# Altium schematic sheet 10.PCIE2.SchDoc
size 297 x 209 mm; SheetNumber: 10; SheetTotal: 13
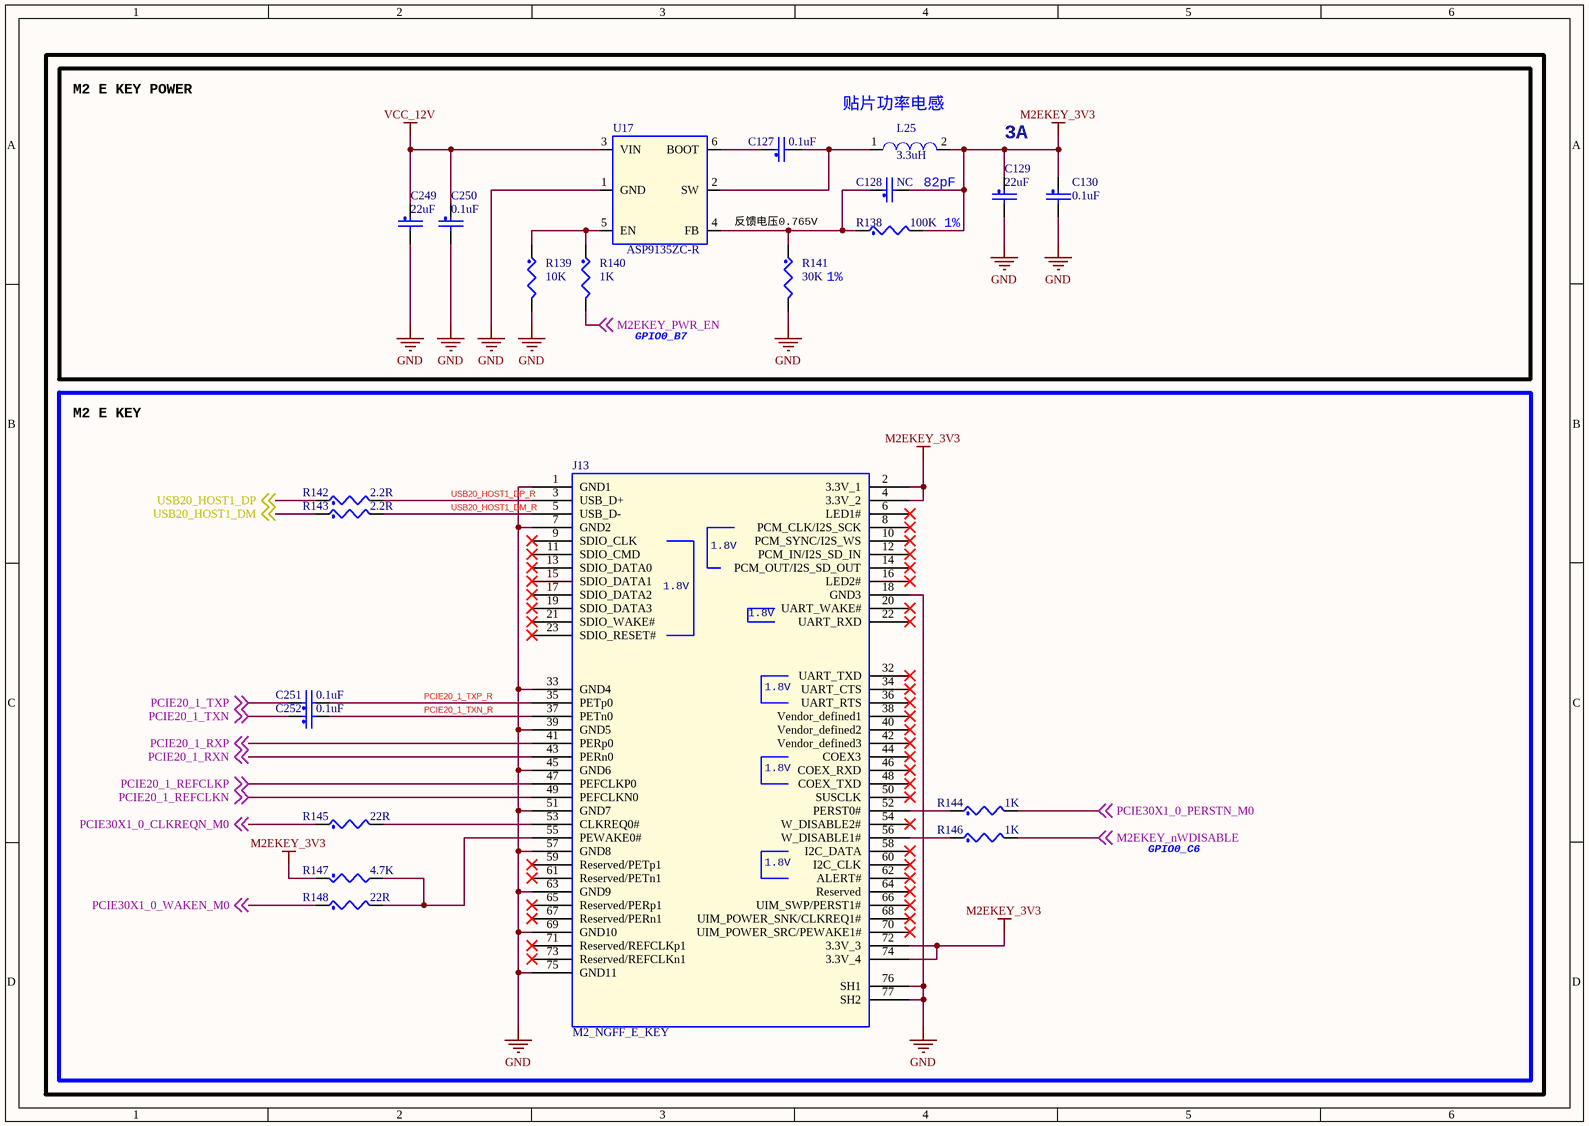
[diagram p0: 10.PCIE2.SchDoc]

## Parts
C127  0.1uF  [C0402]
C128  NC  [C0402]
C129  22uF  [C0603]
C130  0.1uF  [C0402]
C249  22uF  [C0603]
C250  0.1uF  [C0402]
C251  0.1uF  [C0402]
C252  0.1uF  [C0402]
J13  M2_NGFF_E_KEY  [M2_NGFF_E_KEY]
L25  3.3uH  [l4520]
R138  100K  [R0402]
R139  10K  [R0402]
R140  1K  [R0402]
R141  30K  [R0402]
R142  2.2R  [R0402]
R143  2.2R  [R0402]
R144  1K  [R0402]
R145  22R  [R0402]
R146  1K  [R0402]
R147  4.7K  [R0402]
R148  22R  [R0402]
U17  ASP9135ZC-R  [SOT23_6]

## Blocks framed on the sheet
3A: C127-C130 C249 C250 L25 R138-R141 U17
M2 E KEY: C251 C252 J13 R142-R148

## Nets
GND: C129.2 C130.2 C249.2 C250.2 J13.1(GND1) J13.7(GND2) J13.18(GND3) J13.33(GND4) J13.39(GND5) J13.45(GND6) J13.51(GND7) J13.57(GND8) J13.63(GND9) J13.69(GND10) J13.75(GND11) J13.76(SH1) J13.77(SH2) R139.2 R141.2 U17.1(GND)
M2EKEY_3V3: C128.2 C129.1 C130.1 J13.2(3.3V_1) J13.4(3.3V_2) J13.72(3.3V_3) J13.74(3.3V_4) L25.2 R138.2 R147.1
VCC_12V: C249.1 C250.1 U17.3(VIN)
M2EKEY_nWDISABLE: R146.2 ; off-sheet M2EKEY_nWDISABLE
M2EKEY_PWR_EN: R140.2 ; off-sheet M2EKEY_PWR_EN
PCIE20_1_REFCLKN: J13.49(PEFCLKN0) ; off-sheet PCIE20_1_REFCLKN
PCIE20_1_REFCLKP: J13.47(PEFCLKP0) ; off-sheet PCIE20_1_REFCLKP
PCIE20_1_RXN: J13.43(PERn0) ; off-sheet PCIE20_1_RXN
PCIE20_1_RXP: J13.41(PERp0) ; off-sheet PCIE20_1_RXP
PCIE20_1_TXN: C252.1 ; off-sheet PCIE20_1_TXN
PCIE20_1_TXN_R: C252.2 J13.37(PETn0)
PCIE20_1_TXP: C251.1 ; off-sheet PCIE20_1_TXP
PCIE20_1_TXP_R: C251.2 J13.35(PETp0)
PCIE30X1_0_CLKREQN_M0: R145.1 ; off-sheet PCIE30X1_0_CLKREQN_M0
PCIE30X1_0_PERSTN_M0: R144.2 ; off-sheet PCIE30X1_0_PERSTN_M0
PCIE30X1_0_WAKEN_M0: R148.1 ; off-sheet PCIE30X1_0_WAKEN_M0
USB20_HOST1_DM: R143.1 ; off-sheet USB20_HOST1_DM
USB20_HOST1_DM_R: J13.5(USB_D-) R143.2
USB20_HOST1_DP: R142.1 ; off-sheet USB20_HOST1_DP
USB20_HOST1_DP_R: J13.3(USB_D+) R142.2
NetC127_1: C127.1 U17.6(BOOT)
NetC127_2: C127.2 L25.1 U17.2(SW)
NetC128_1: C128.1 R138.1 R141.1 U17.4(FB)
NetJ13_52: J13.52(PERST0#) R144.1
NetJ13_53: J13.53(CLKREQ0#) R145.2
NetJ13_55: J13.55(PEWAKE0#) R147.2 R148.2
NetJ13_56: J13.56(W_DISABLE1#) R146.1
NetR139_1: R139.1 R140.1 U17.5(EN)

Not connected (* = marked no-connect by the designer): J13 6(LED1#)* 8(PCM_CLK/I2S_SCK)* 9(SDIO_CLK)* 10(PCM_SYNC/I2S_WS)* 11(SDIO_CMD)* 12(PCM_IN/I2S_SD_IN)* 13(SDIO_DATA0)* 14(PCM_OUT/I2S_SD_OUT)* 15(SDIO_DATA1)* 16(LED2#)* 17(SDIO_DATA2)* 19(SDIO_DATA3)* 20(UART_WAKE#)* 21(SDIO_WAKE#)* 22(UART_RXD)* 23(SDIO_RESET#)* 32(UART_TXD)* 34(UART_CTS)* 36(UART_RTS)* 38(Vendor_defined1)* 40(Vendor_defined2)* 42(Vendor_defined3)* 44(COEX3)* 46(COEX_RXD)* 48(COEX_TXD)* 50(SUSCLK)* 54(W_DISABLE2#)* 58(I2C_DATA)* 59(Reserved/PETp1)* 60(I2C_CLK)* 61(Reserved/PETn1)* 62(ALERT#)* 64(Reserved)* 65(Reserved/PERp1)* 66(UIM_SWP/PERST1#)* 67(Reserved/PERn1)* 68(UIM_POWER_SNK/CLKREQ1#)* 70(UIM_POWER_SRC/PEWAKE1#)* 71(Reserved/REFCLKp1)* 73(Reserved/REFCLKn1)*

## Notes on the sheet
- M2 E KEY POWER
- (near L25) 贴片功率电感
- 82pF
- 反馈电压0.765V
- 1%
- GPIO0_B7
- GPIO0_C6
- (in symbol M2_NGFF_E_KEY) 1.8V

## Library data of the parts
C127-C130 C249-C252 = CAP_NP
L25 = IND
R138-R148 = RES
U17 = TP6327GS6